# Altium project Softcore_SA_HW.PrjPcb
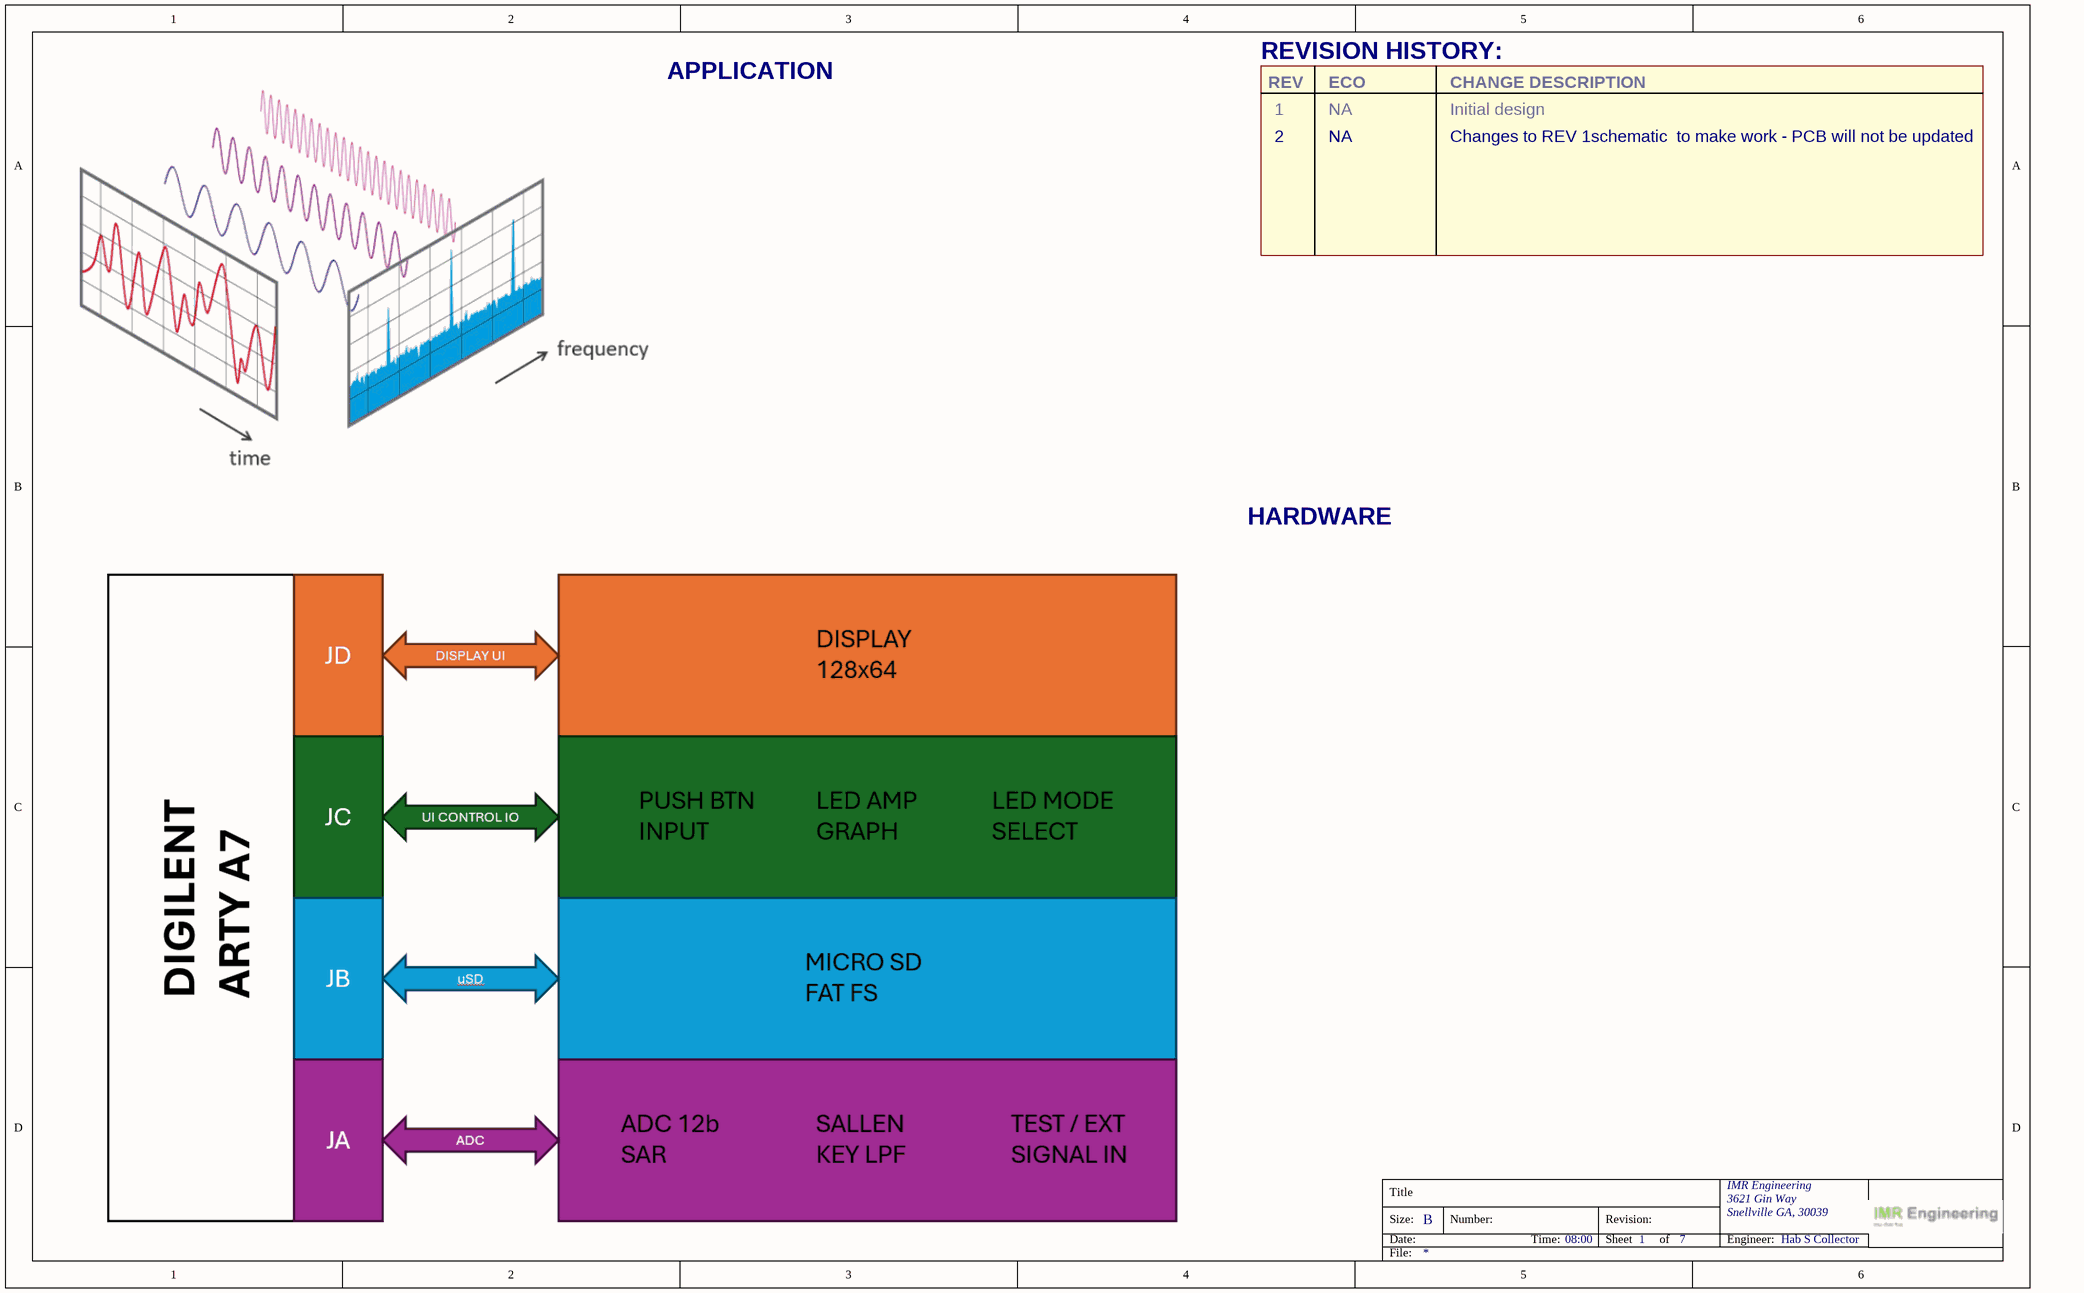
[diagram p0: SoftCore_SA_P1.SchDoc]
ProjectTitle: SoftCore SA Adapter; ProjectTime: 08:00; ProjectRevision: 2; ProjectDocumentNumber: IMR-006-SCH; ProjectDate: 02/26/26
2 sheets, 42 parts. Net scope: flat (ports and power ports of the same name join across sheets).
Sheets:
  SoftCore_SA_P1.SchDoc
  SoftCore_SA_P6.SchDoc

## Sheet SoftCore_SA_P1.SchDoc: =ProjectTitle
size B; Date: 02/26/26; Engineer: Hab S Collector; Address1: 3621 Gin Way; Address2: Snellville GA, 30039; DocumentNumber: IMR-006-SCH; Revision: 2; SheetNumber: 1; SheetTotal: 7

### Notes on the sheet
- APPLICATION
- REVISION HISTORY:
- REV
- ECO
- CHANGE DESCRIPTION
- 1
- 2
- NA
- Initial design
- Changes to REV 1schematic  to make work - PCB will not be updated
- HARDWARE
- Title
- Size:
- Date:
- B
- Number:
- Time:
- Revision:
- Sheet
- of
- IMR Engineering
- Engineer:
- File:

## Sheet SoftCore_SA_P6.SchDoc: =ProjectTitle
size B; Date: 02/26/26; Engineer: Hab S Collector; Address1: 3621 Gin Way; Address2: Snellville GA, 30039; DocumentNumber: IMR-006-SCH; Revision: 2; SheetNumber: 6; SheetTotal: 7
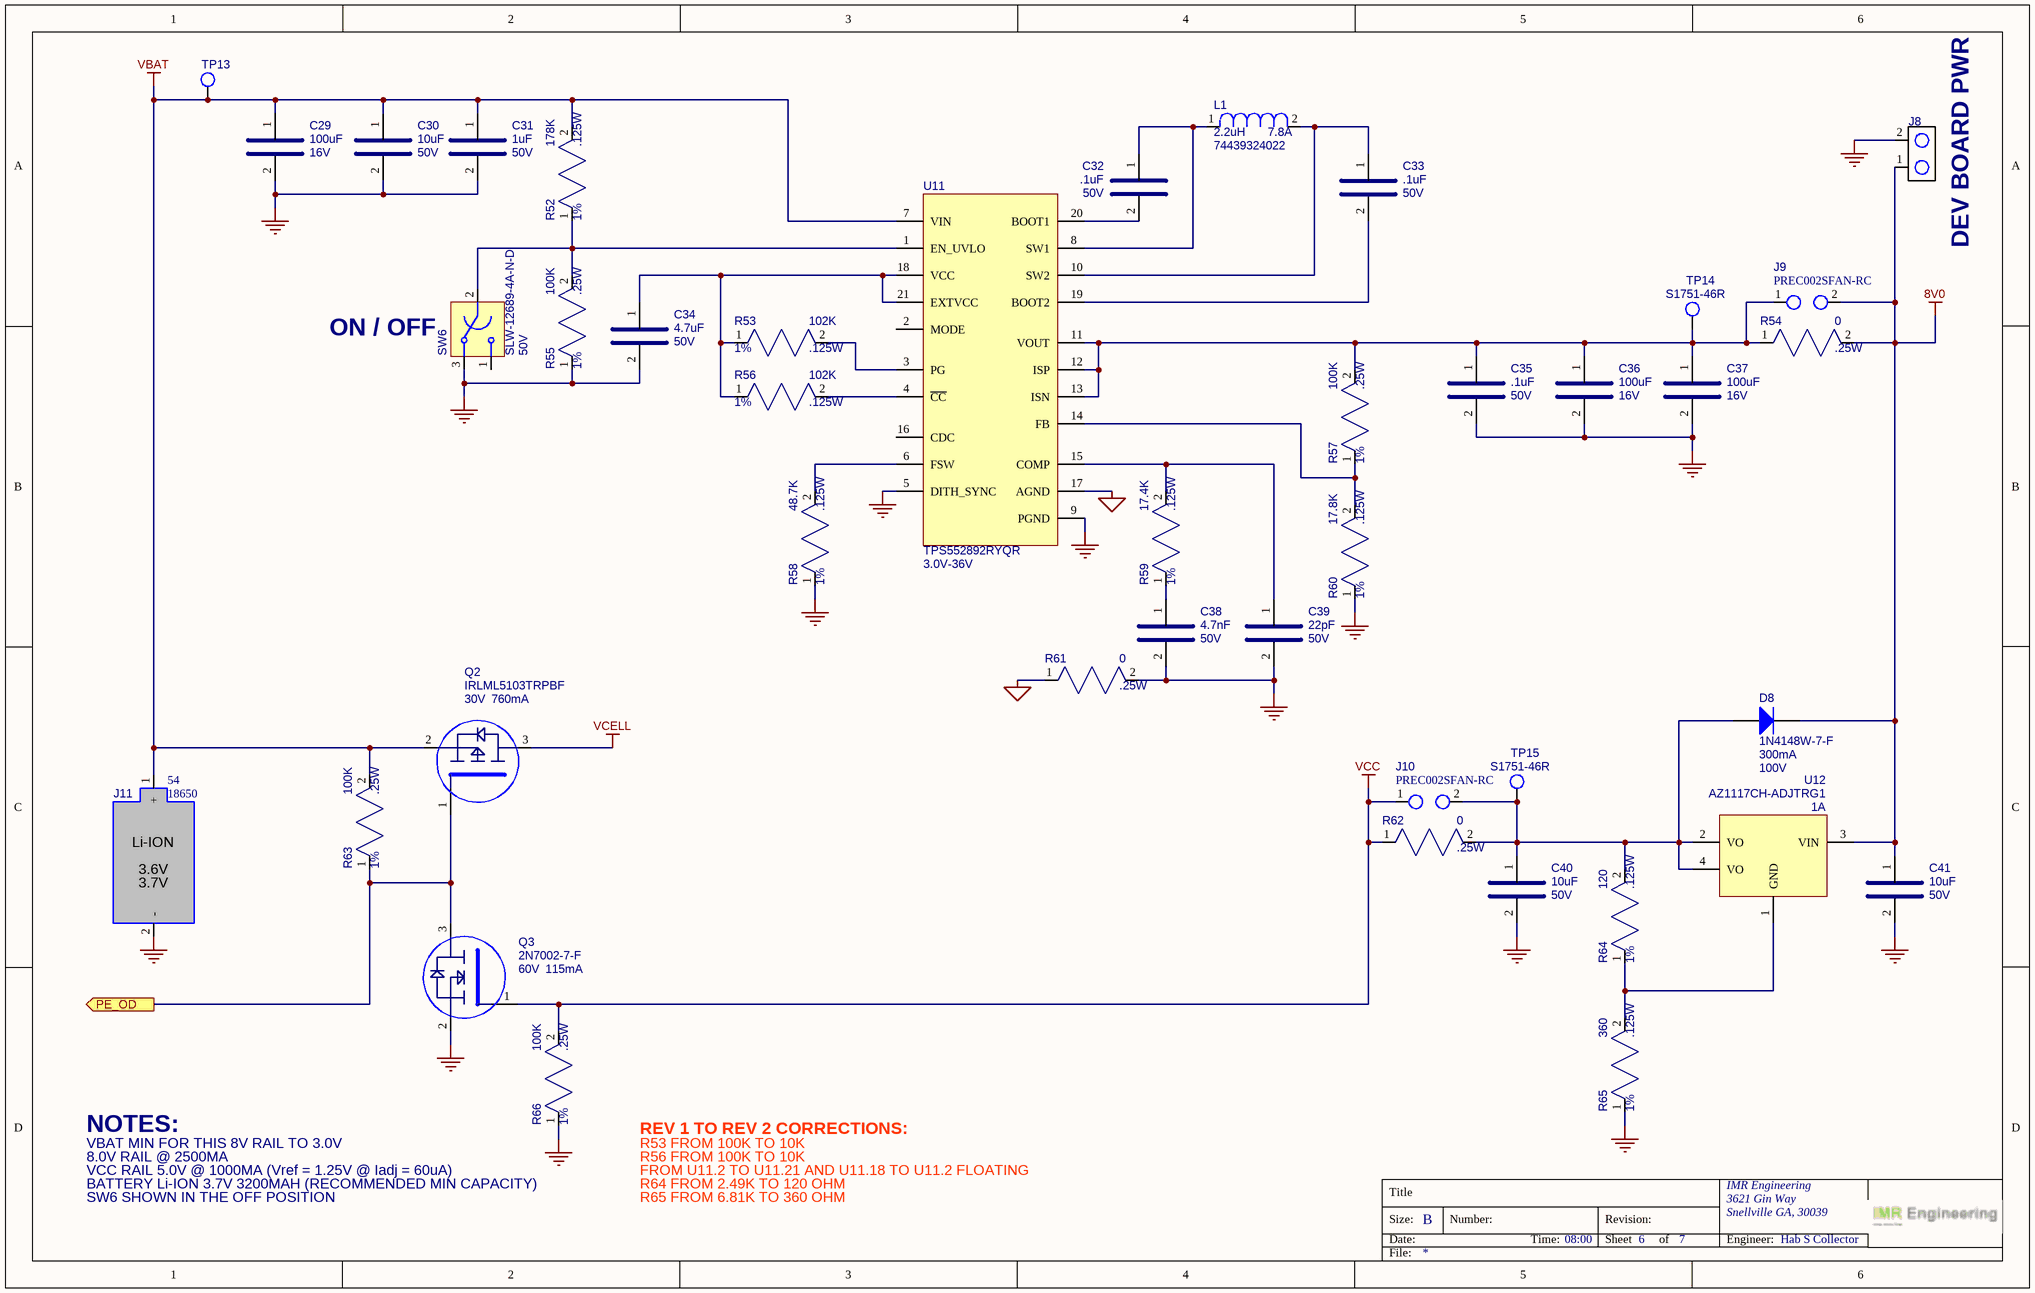
[diagram p1: SoftCore_SA_P6.SchDoc]

### Parts
C29  value 100uF  Voltage: 16V  [CAP_1210]  (hidden comment: EMK325ABJ107MM-P)
C30  value 10uF  Voltage: 50V  [CAP_0805]  (hidden comment: GRM21BR61H106KE43L)
C31  value 1uF  Voltage: 50V  [CAP_0805]  (hidden comment: 08055C105K4T2A)
C32  value .1uF  Voltage: 50V  [CAP_0805]  (hidden comment: KGM21NR71H104KT)
C33  value .1uF  Voltage: 50V  [CAP_0805]  (hidden comment: KGM21NR71H104KT)
C34  value 4.7uF  Voltage: 50V  [CAP_0805]  (hidden comment: GRM21BR61H475KE51L)
C35  value .1uF  Voltage: 50V  [CAP_0805]  (hidden comment: KGM21NR71H104KT)
C36  value 100uF  Voltage: 16V  [CAP_1210]  (hidden comment: EMK325ABJ107MM-P)
C37  value 100uF  Voltage: 16V  [CAP_1210]  (hidden comment: EMK325ABJ107MM-P)
C38  value 4.7nF  Voltage: 50V  [CAP_0805]  (hidden comment: C0805C472K5RACAUTO)
C39  value 22pF  Voltage: 50V  [CAP_0805]  (hidden comment: C0805C220K5RACAUTO)
C40  value 10uF  Voltage: 50V  [CAP_0805]  (hidden comment: GRM21BR61H106KE43L)
C41  value 10uF  Voltage: 50V  [CAP_0805]  (hidden comment: GRM21BR61H106KE43L)
D8  value 100V  Current: 300mA  [SOD123]  (hidden comment: 1N4148W-7-F)
J8  PREC002SFAN-RC  [HDR_1X2_100MILL]  (value not drawn)
J9  PREC002SFAN-RC  [HDR_1X2_100MILL]
J10  PREC002SFAN-RC  [HDR_1X2_100MILL]
J11  value 18650  [CONN_BATTERY_18650]  (hidden comment: 54)
L1  value 2.2uH  Current: 7.8A  [WE-XHMI_4030]  (hidden comment: 74439324022)
Q2  value 30V  Current: 760mA  [SOT-23]  (hidden comment: IRLML5103TRPBF)
Q3  value 60V  Current: 115mA  [SOT-23]  (hidden comment: 2N7002-7-F)
R52  value 178K  Power: .125W  Tolerance: 1%  [RES_0805]  (hidden comment: RC0805FR-07178KL)
R53  value 102K  Power: .125W  Tolerance: 1%  [RES_0805]  (hidden comment: RC0805FR-07102KL)
R54  value 0  Power: .25W  [RES_0805]  (hidden comment: RC0805JR-070RL)
R55  value 100K  Power: .25W  Tolerance: 1%  [RES_0805]  (hidden comment: RC0805FR-07100KL)
R56  value 102K  Power: .125W  Tolerance: 1%  [RES_0805]  (hidden comment: RC0805FR-07102KL)
R57  value 100K  Power: .25W  Tolerance: 1%  [RES_0805]  (hidden comment: RC0805FR-07100KL)
R58  value 48.7K  Power: .125W  Tolerance: 1%  [RES_0805]  (hidden comment: RC0805FR-0748K7L)
R59  value 17.4K  Power: .125W  Tolerance: 1%  [RES_0805]  (hidden comment: RC0805FR-0717K4L)
R60  value 17.8K  Power: .125W  Tolerance: 1%  [RES_0805]  (hidden comment: RC0805FR-0717K8L)
R61  value 0  Power: .25W  [RES_0805]  (hidden comment: RC0805JR-070RL)
R62  value 0  Power: .25W  [RES_0805]  (hidden comment: RC0805JR-070RL)
R63  value 100K  Power: .25W  Tolerance: 1%  [RES_0805]  (hidden comment: RC0805FR-07100KL)
R64  value 120  Power: .125W  Tolerance: 1%  [RES_0805]  (hidden comment: RC0805FR-132K49L)
R65  value 360  Power: .125W  Tolerance: 1%  [RES_0805]  (hidden comment: RC0805FR-076K81L)
R66  value 100K  Power: .25W  Tolerance: 1%  [RES_0805]  (hidden comment: RC0805FR-07100KL)
SW6  value 50V  [SLW126894AND]  (hidden comment: SLW-12689-4A-N-D)
TP13  (no value)  [TEST_POINT_20MIL_TH]  (no BOM)
TP14  S1751-46R  [HARWIN_S1751]
TP15  S1751-46R  [HARWIN_S1751]
U11  value 3.0V-36V  [CONV_TPS552892RYQR]  (hidden comment: TPS552892RYQR)
U12  Current: 1A  [SOT223]  (hidden comment: AZ1117CH-ADJTRG1)

### Ports
PE_OD (out)

### Nets
8V0: C41.1 D8.2(K) J8.1 J9.2 R54.2 U12.3(VIN)
AGND: R61.1 U11.17(AGND)
GND: C29.2 C30.2 C31.2 C34.2 C35.2 C36.2 C37.2 C38.2 C39.2 C40.2 C41.2 J8.2 J11.2(-) Q3.2(E) R55.1 R58.1 R60.1 R61.2 R65.1 R66.1 SW6.3 U11.5(DITH_SYNC) U11.9(PGND)
VBAT: C29.1 C30.1 C31.1 J11.1(+) Q2.2(S) R52.2 R63.2 TP13.1 U11.7(VIN)
VCC: J10.1 Q3.1(B) R62.1 R66.2
VCELL: Q2.3(D)
NetC32_1: C32.1 L1.1 U11.8(SW1)
NetC32_2: C32.2 U11.20(BOOT1)
NetC33_1: C33.1 L1.2 U11.10(SW2)
NetC33_2: C33.2 U11.19(BOOT2)
NetC34_1: C34.1 R53.1 R56.1 U11.18(VCC) U11.21(EXTVCC)
NetC35_1: C35.1 C36.1 C37.1 J9.1 R54.1 R57.2 TP14.1 U11.11(VOUT) U11.12(ISP) U11.13(ISN)
NetC38_1: C38.1 R59.1
NetC39_1: C39.1 R59.2 U11.15(COMP)
NetC40_1: C40.1 D8.1(A) J10.2 R62.2 R64.2 TP15.1 U12.2(VO) U12.4(VO)
NetQ2_1: Q2.1(G) Q3.3(C) R63.1 ; port PE_OD
NetR52_1: R52.1 R55.2 SW6.2 U11.1(EN_UVLO)
NetR53_2: R53.2 U11.3(PG)
NetR56_2: R56.2 U11.4(~{CC})
NetR57_1: R57.1 R60.2 U11.14(FB)
NetR58_2: R58.2 U11.6(FSW)
NetR64_1: R64.1 R65.2 U12.1(GND)

Not connected (* = marked no-connect by the designer): SW6 1; U11 2(MODE) 16(CDC)

### Notes on the sheet
- (near J8) DEV BOARD PWR
- (near SW6) ON / OFF
- VBAT MIN FOR THIS 8V RAIL TO 3.0V
- NOTES:
- 8.0V RAIL @ 2500MA
- VCC RAIL 5.0V @ 1000MA (Vref = 1.25V @ Iadj = 60uA)
- REV 1 TO REV 2 CORRECTIONS:
- R53 FROM 100K TO 10K
- R56 FROM 100K TO 10K
- FROM U11.2 TO U11.21 AND U11.18 TO U11.2 FLOATING
- BATTERY Li-ION 3.7V 3200MAH (RECOMMENDED MIN CAPACITY)
- SW6 SHOWN IN THE OFF POSITION
- R64 FROM 2.49K TO 120 OHM
- R65 FROM 6.81K TO 360 OHM
- Title
- Size:
- Date:
- B
- Number:
- Time:
- Revision:
- Sheet
- of
- IMR Engineering
- Engineer:
- File:
- (in symbol CONN_BATT_18650) Li-ION; 3.6V; 3.7V

### Library data of the parts
C29 C36 C37 = CAP_SMD_100UF_16V_SMD: CAP CER 100UF 16V X7S SMD; MFG: Taiyo Yuden; Case/Package: CAPC6153X670N; MFG_PN: EMK325ABJ107MM-P; Supplier 1: DigiKey; Supplier Part Number 1: 587-5426-1-ND; Unit Price: 1.92
C30 C40 C41 = CAP_SMD_10UF_50V_0805: CAP CER 10UF 50V X5R 0805; MFG: Murata Electronics; Case/Package: 0805; MFG_PN: GRM21BR61H106KE43L; Supplier 1: DigiKey; Supplier Part Number 1: 490-18663-1-ND; Unit Price: .28
C31 = CAP_SMD_1UF_50V_0805: CAP CER 1UF 50V X7R 0805; MFG: KYOCERA AVX; Case/Package: 0805; MFG_PN: 08055C105K4T2A; Supplier 1: DigiKey; Supplier Part Number 1: 478-KAM21KR71H105KUCT-ND; Unit Price: .27
C32 C33 C35 = CAP_SMD_0.1UF_50V_0805: CAP CER 0.1UF 50V X7R 0805; MFG: KYOCERA AVX; Case/Package: 0805; MFG_PN: KGM21NR71H104KT; Supplier 1: DigiKey; Supplier Part Number 1: 478-KGM21NR71H104KTCT-ND; Unit Price: .1
C34 = CAP_SMD_4.7UF_50V_0805: CAP CER 4.7UF 50V X5R 0805; MFG: Murata Electronics; Case/Package: 0805; MFG_PN: GRM21BR61H475KE51L; Supplier 1: DigiKey; Supplier Part Number 1: 490-10751-1-ND; Unit Price: .19
C38 = CAP_SMD_4.7NF_50V_0805: CAP CER 4.7NF 50V X7R 0805; MFG: KEMET; Case/Package: 0805; MFG_PN: C0805C472K5RACAUTO; Supplier 1: DigiKey; Supplier Part Number 1: 399-6969-1-ND; Unit Price: .12
C39 = CAP_SMD_22PF_50V_0805: CAP CER 22PF 50V X7R 0805; MFG: KEMET; Case/Package: 0805; MFG_PN: C0805C220K5RACAUTO; Supplier 1: DigiKey; Supplier Part Number 1: 399-17627-1-ND; Unit Price: .24
D8 = DIODE_1N4148W-7-F: RELAY REED SPDT 250MA 5V; MFG: Diodes Inc; Case/Package: SOD-123; Supplier 1: DigiKey; Supplier Part Number 1: 1N4148W-FDICT-ND; Unit Price: .16; MFG_PN: 1N4148W-7-F
J8 = CONN_HEADER_2P_100MIL_VERT: CONN HEADER VERT 2POS 2.54MM; MFG: Sullins Connector Solutions; Case/Package: 2P_2.54MM; Supplier 1: Digi-Key; Supplier Part Number 1: S1212EC-02-ND; Value: *; Unit Price: .07; MFG_PN: PREC002SFAN-RC
J9 J10 = CONN_JUMPER_2P_100MIL_VERT: CONN HEADER VERT 2POS 2.54MM; MFG: Sullins Connector Solutions; Case/Package: 2P_2.54MM; MFG_PN: PREC002SFAN-RC; Supplier 1: Digi-Key; Supplier Part Number 1: S1212EC-02-ND; Value: *; Unit Price: .07
J11 = CONN_BATT_18650: CONN HEADER VERT 2POS 2.54MM; MFG: Keystone Electronics; Note: This is actually 2 connectors on PCB - priced as such but BOM will reflect only one; Case/Package: 18650 SINGLE CELL; Supplier 1: Digi-Key; Supplier Part Number 1: 36-54-ND; Unit Price: 1.10; MFG_PN: 54
L1 = INDUCTOR_74439324022: POWER INDUCTOR 4030; 2.2UH; 7.80; MFG: Würth Elektronik; Tolerance: 20%; Case/Package: WE-XHMI; Supplier 1: DigiKey; Supplier Part Number 1: 732-74439324022CT-ND; Unit Price: 1.80; MFG_PN: 74439324022
Q2 = MOSFET_PCH_IRLML5103TRPBF: MOSFET P-CH 30V 760MA SOT23; MFG: Infineon Technologies; Case/Package: 8-PowerTDFN; Supplier 1: DigiKey; Supplier Part Number 1: IRLML5103PBFCT-ND; Unit Price: .45; MFG_PN: IRLML5103TRPBF
Q3 = MOSFET_NCH_2N7002-7-F: MOSFET N-CH 60V 115MA SOT23-3; MFG: Diodes Inc; Case/Package: SOT-23; Supplier 1: DigiKey; Supplier Part Number 1: 2N7002-FDICT-ND; Unit Price: .20; MFG_PN: 2N7002-7-F
R52 = RES_SMD_178K_0805_1/8W_1%: RES SMD 178K OHM 1% 1/8W 0805; MFG: Yageo; Case/Package: 0805; MFG_PN: RC0805FR-07178KL; Supplier 1: DigiKey; Supplier Part Number 1: 311-178KCRCT-ND; Unit Price: .10
R53 R56 = RES_SMD_102K_0805_1/8W_1%: RES SMD 102K OHM 1% 1/8W 0805; MFG: Yageo; Case/Package: 0805; MFG_PN: RC0805FR-07102KL; Supplier 1: DigiKey; Supplier Part Number 1: 311-102KCRCT-ND; Unit Price: .10
R54 R61 R62 = RES_SMD_0_0805_1/8W_1%: RES SMD 0 OHM 1% 1/8W 0805; MFG: Yageo; Case/Package: 0805; MFG_PN: RC0805JR-070RL; Supplier 1: DigiKey; Supplier Part Number 1: 311-0.0ARCT-ND; Unit Price: .1; Tolerance: 1%
R55 R57 R63 R66 = RES_SMD_100K_0805_1/4W_1%: RES SMD 100K OHM 1% 1/4W 0805; MFG: Yageo; Case/Package: 0805; MFG_PN: RC0805FR-07100KL; Supplier 1: DigiKey; Supplier Part Number 1: 311-100KCRCT-ND; Unit Price: .13
R58 = RES_SMD_48.7K_0805_1/8W_1%: RES SMD 48.7K OHM 1% 1/8W 0805; MFG: Yageo; Case/Package: 0805; MFG_PN: RC0805FR-0748K7L; Supplier 1: DigiKey; Supplier Part Number 1: 311-48.7KCRCT-ND; Unit Price: .1
R59 = RES_SMD_17.4K_0805_1/8W_1%: RES SMD 17.4K OHM 1% 1/8W 0805; MFG: Yageo; Case/Package: 0805; MFG_PN: RC0805FR-0717K4L; Supplier 1: DigiKey; Supplier Part Number 1: 311-17.4KCRCT-ND; Unit Price: .10
R60 = RES_SMD_17.8K_0805_1/8W_1%: RES SMD 17.8K OHM 1% 1/8W 0805; MFG: Yageo; Case/Package: 0805; MFG_PN: RC0805FR-0717K8L; Supplier 1: DigiKey; Supplier Part Number 1: 311-17.8KCRCT-ND; Unit Price: .10
R64 = RES_SMD_2.49K_0805_1/8W_1%: RES SMD 2.49K OHM 1% 1/8W 0805; MFG: Yageo; Case/Package: 0805; MFG_PN: RC0805FR-132K49L; Supplier 1: DigiKey; Supplier Part Number 1: 13-RC0805FR-132K49LCT-ND; Unit Price: .1
R65 = RES_SMD_6.81K_0805_1/8W_1%: RES SMD 6.81K OHM 1% 1/8W 0805; MFG: Yageo; Case/Package: 0805; MFG_PN: RC0805FR-076K81L; Supplier 1: DigiKey; Supplier Part Number 1: 311-6.81KCRCT-ND; Unit Price: .10
SW6 = SWITCH_SLW-12689-4A-N-D: SWITCH SLIDE SPDT 300MA 50V; MFG: Same Sky; Case/Package: SLW-12689-4A-N-D; Supplier 1: DigiKey; Supplier Part Number 1: 2223-SLW-12689-4A-N-D-ND; Unit Price: .48; Current: 300mA; MFG_PN: SLW-12689-4A-N-D
TP13 = CONN_TEST_POINT_TH_PAD_20MIL: TEST POINT TH 20MIL HOLE
TP14 TP15 = CONN_TEST_POINT_S1751-46R: PCB TEST POINT CONNECT; MFG: Harwin Inc; Case/Package: S1751; Supplier 1: Digi-Key; Supplier Part Number 1: 952-1478-1-ND; Value: *; Unit Price: .28; MFG_PN: S1751-46R
U11 = IC_SMPS_TPS552892RYQR: IC REG BUCK ADJ 1A 16HTSSOP; MFG: Texas Instruments; Current: 8A; Case/Package: VQFN; Supplier 1: DigiKey; Supplier Part Number 1: 296-TPS552892RYQRCT-ND; Unit Price: 6.42; MFG_PN: TPS552892RYQR
U12 = IC_REG_AZ1117CH-ADJTRG1: IC REG BUCK ADJ 2A SOT23; MFG: Diodes Incorporated; Case/Package: SOT-223-3; Supplier 1: DigiKey; Supplier Part Number 1: AZ1117CH-ADJTRG1DICT-ND; Unit Price: .2; VALUE: ADJ; MFG_PN: AZ1117CH-ADJTRG1